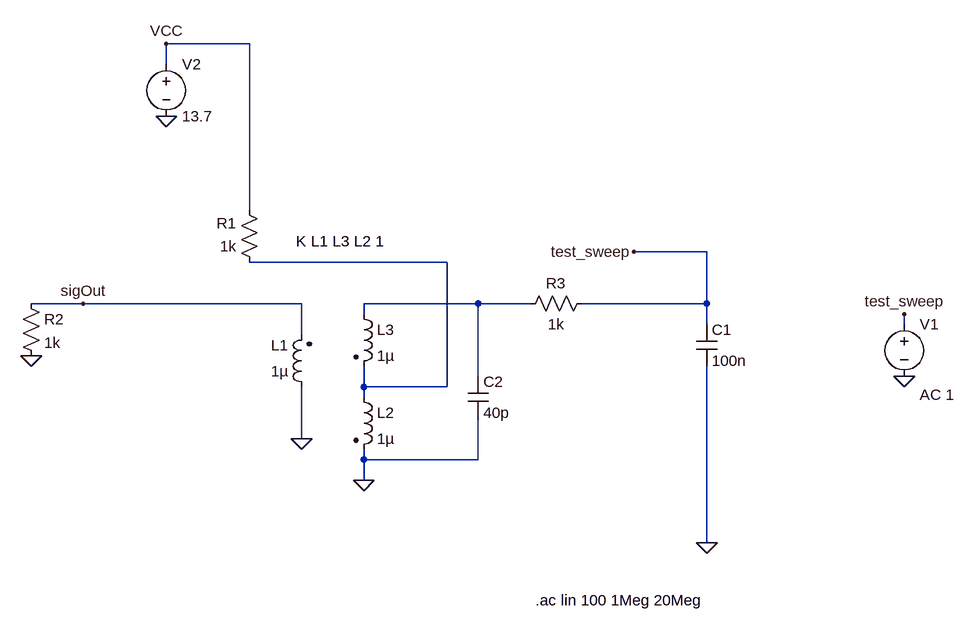
[diagram p0: schematic mc1496_transformer_characterisation.asc]
mc1496_transformer_characterisation.asc, the LTspice schematic file:
Version 4
SHEET 1 880 680
WIRE -336 -336 -464 -336
WIRE -464 -304 -464 -336
WIRE -336 -80 -336 -336
WIRE 368 -16 256 -16
WIRE -32 0 -336 0
WIRE -592 64 -672 64
WIRE -256 64 -592 64
WIRE 16 64 -160 64
WIRE 96 64 16 64
WIRE 368 64 368 -16
WIRE 368 64 176 64
WIRE -160 80 -160 64
WIRE 368 96 368 64
WIRE 672 96 672 80
WIRE -256 112 -256 64
WIRE 16 176 16 64
WIRE -160 192 -160 160
WIRE -32 192 -32 0
WIRE -32 192 -160 192
WIRE -160 208 -160 192
WIRE -256 272 -256 192
WIRE -160 304 -160 288
WIRE 16 304 16 240
WIRE 16 304 -160 304
WIRE -160 336 -160 304
WIRE 368 432 368 160
FLAG 672 176 0
FLAG 672 80 test_sweep
FLAG -464 -224 0
FLAG -464 -336 VCC
FLAG -672 144 0
FLAG -592 64 sigOut
FLAG 368 432 0
FLAG 256 -16 test_sweep
FLAG -256 272 0
FLAG -160 336 0
SYMBOL voltage 672 80 R0
WINDOW 123 24 124 Left 2
WINDOW 39 0 0 Left 0
SYMATTR Value2 AC 1
SYMATTR InstName V1
SYMATTR Value ""
SYMBOL voltage -464 -320 R0
WINDOW 123 0 0 Left 0
WINDOW 39 0 0 Left 0
SYMATTR InstName V2
SYMATTR Value 13.7
SYMBOL ind2 -240 208 R180
WINDOW 0 36 80 Left 2
WINDOW 3 36 40 Left 2
SYMATTR InstName L1
SYMATTR Value 1µ
SYMATTR Type ind
SYMBOL ind2 -176 192 R0
SYMATTR InstName L2
SYMATTR Value 1µ
SYMATTR Type ind
SYMBOL ind2 -176 64 R0
SYMATTR InstName L3
SYMATTR Value 1µ
SYMATTR Type ind
SYMBOL cap 352 96 R0
SYMATTR InstName C1
SYMATTR Value 100n
SYMBOL res -320 16 R180
WINDOW 0 36 76 Left 2
WINDOW 3 36 40 Left 2
SYMATTR InstName R1
SYMATTR Value 1k
SYMBOL res -688 48 R0
SYMATTR InstName R2
SYMATTR Value 1k
SYMBOL res 192 48 R90
WINDOW 0 0 56 VBottom 2
WINDOW 3 32 56 VTop 2
SYMATTR InstName R3
SYMATTR Value 1k
SYMBOL cap 0 176 R0
SYMATTR InstName C2
SYMATTR Value 40p
TEXT -264 -32 Left 2 !K L1 L3 L2 1
TEXT 104 520 Left 2 !.ac lin 100 1Meg 20Meg

The netlist it stands for:
* mc1496_transformer_characterisation.asc
V1 test_sweep 0 AC 1
V2 VCC 0 13.7
L1 0 sigOut 1µ
L2 N001 0 1µ
L3 N002 N001 1µ
C1 test_sweep 0 100n
R1 N001 VCC 1k
R2 sigOut 0 1k
R3 test_sweep N002 1k
C2 N002 0 40p
K L1 L3 L2 1
.ac lin 100 1Meg 20Meg
.backanno
.end